# Altium schematic sheet 7_seg_display.SchDoc
size Letter; SheetNumber: 2; SheetTotal: 3
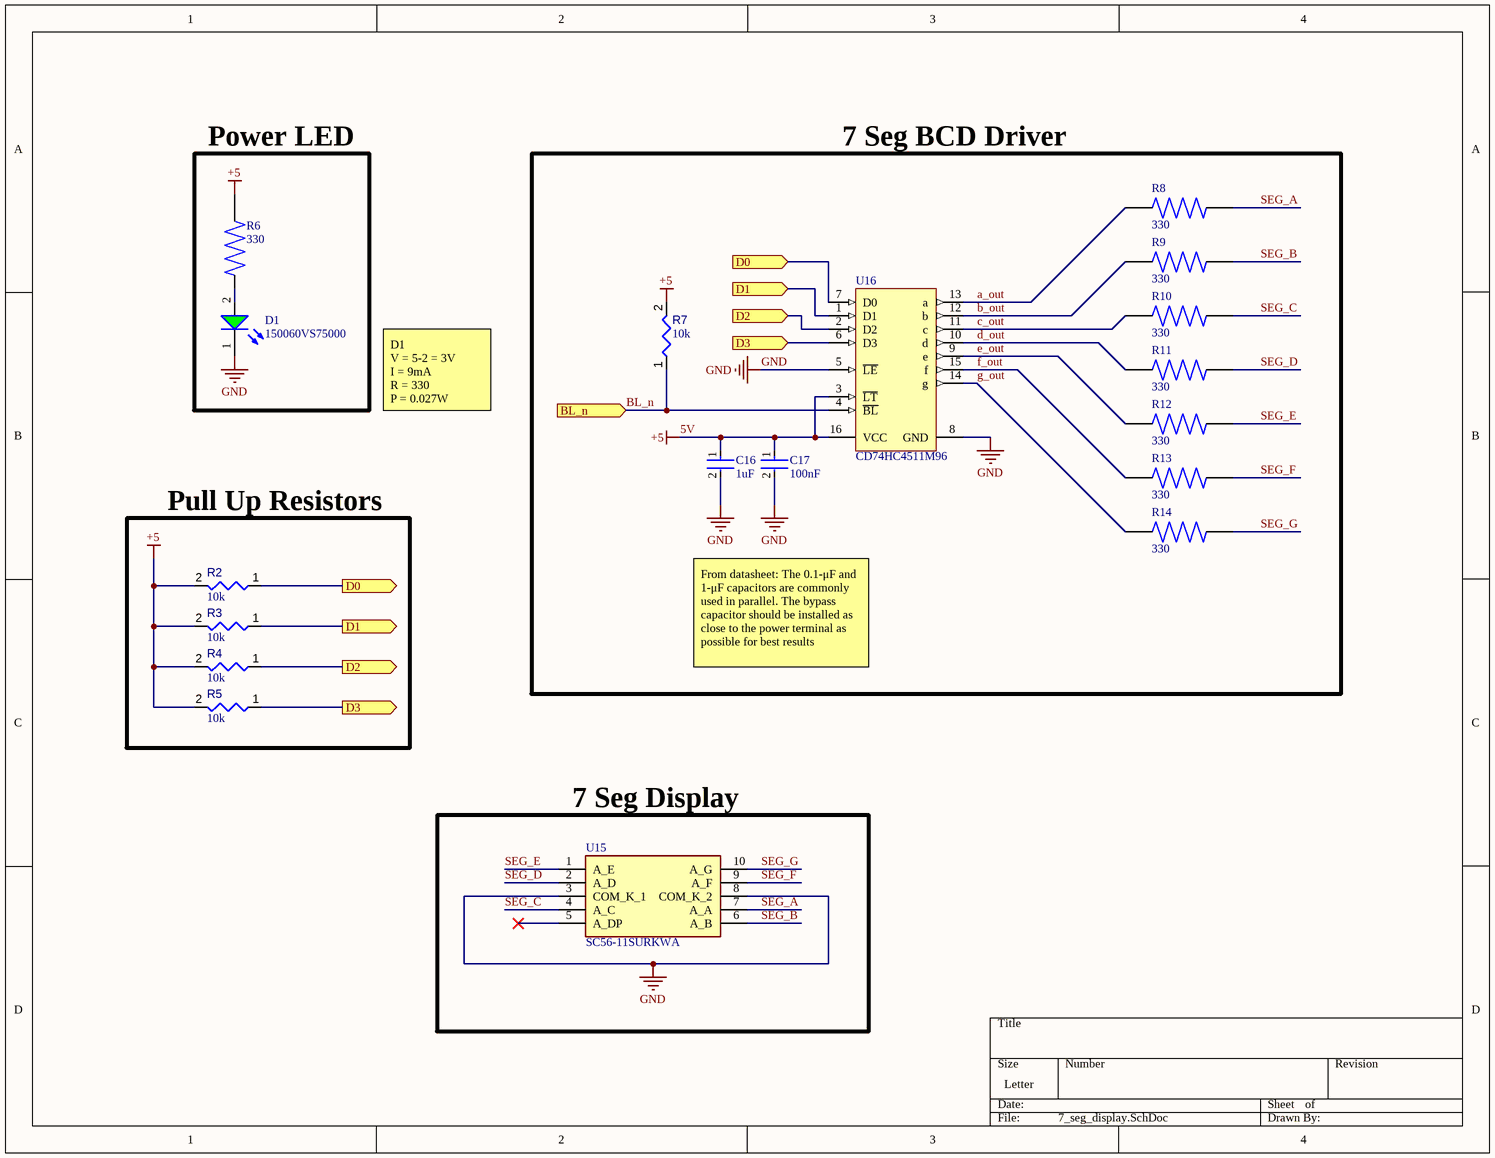
[diagram p0: 7_seg_display.SchDoc]

## Parts
C16  1uF  [FP-CGA3E-0_3-0_1-IPC_A]
C17  100nF  [FP-CL10-IPC_A]
D1  150060VS75000  [WL-SMCW_0603_150060xx75000]
R2  value 10k  [RESC1608X55X25ML10T15]  (hidden comment: Resistor 10k +/-1% 0603 100 mW)
R3  value 10k  [RESC1608X55X25ML10T15]  (hidden comment: Resistor 10k +/-1% 0603 100 mW)
R4  value 10k  [RESC1608X55X25ML10T15]  (hidden comment: Resistor 10k +/-1% 0603 100 mW)
R5  value 10k  [RESC1608X55X25ML10T15]  (hidden comment: Resistor 10k +/-1% 0603 100 mW)
R6  value 330  [RES_ERJ-PB3B3300V]  (hidden comment: ERJ-PB3B3300V)
R7  value 10k  [RESC1608X55X25ML10T15]  (hidden comment: Resistor 10k +/-1% 0603 100 mW)
R8  value 330  [RES_ERJ-PB3B3300V]  (hidden comment: ERJ-PB3B3300V)
R9  value 330  [RES_ERJ-PB3B3300V]  (hidden comment: ERJ-PB3B3300V)
R10  value 330  [RES_ERJ-PB3B3300V]  (hidden comment: ERJ-PB3B3300V)
R11  value 330  [RES_ERJ-PB3B3300V]  (hidden comment: ERJ-PB3B3300V)
R12  value 330  [RES_ERJ-PB3B3300V]  (hidden comment: ERJ-PB3B3300V)
R13  value 330  [RES_ERJ-PB3B3300V]  (hidden comment: ERJ-PB3B3300V)
R14  value 330  [RES_ERJ-PB3B3300V]  (hidden comment: ERJ-PB3B3300V)
U15  SC56-11SURKWA  [DIPS1524W75P254L1270H825Q10N]
U16  CD74HC4511M96  [D0016A_N]

## Blocks framed on the sheet
Power LED: D1 R6
7 Seg BCD Driver: C16 C17 R7-R14 U16
Pull Up Resistors: R2-R5
7 Seg Display: U15

## Ports
BL_n (in), D0 (in), D0 (out), D1 (in), D1 (out), D2 (in), D2 (out), D3 (in), D3 (out)

## Nets
5V: C16.1 C17.1 R2.2 R3.2 R4.2 R5.2 R6.2 R7.2 U16.3(~{LT}) U16.16(VCC)  [also labelled +5]
GND: C16.2 C17.2 D1.1(K) U15.3(COM_K_1) U15.8(COM_K_2) U16.5(~{LE}) U16.8(GND)
a_out: R8.2 U16.13(a)
b_out: R9.2 U16.12(b)
BL_n: R7.1 U16.4(~{BL}) ; port BL_n
c_out: R10.2 U16.11(c)
D0: R2.1 U16.7(D0) ; port D0
D1: R3.1 U16.1(D1) ; port D1
D2: R4.1 U16.2(D2) ; port D2
D3: R5.1 U16.6(D3) ; port D3
d_out: R11.2 U16.10(d)
e_out: R12.2 U16.9(e)
f_out: R13.2 U16.15(f)
g_out: R14.1 U16.14(g)
SEG_A: R8.1 U15.7(A_A)
SEG_B: R9.1 U15.6(A_B)
SEG_C: R10.1 U15.4(A_C)
SEG_D: R11.1 U15.2(A_D)
SEG_E: R12.1 U15.1(A_E)
SEG_F: R13.1 U15.9(A_F)
SEG_G: R14.2 U15.10(A_G)
NetD1_2: D1.2(A) R6.1

Not connected (* = marked no-connect by the designer): U15 5(A_DP)*

## Notes on the sheet
- D1
  V = 5-2 = 3V
  I = 9mA
  R = 330
  P = 0.027W
- From datasheet: The 0.1-μF and 1-μF capacitors are commonly used in parallel. The bypass capacitor should be installed as close to the power terminal as possible for best results

## Library data of the parts
C16 = CMP-08246-002161-1: Cap Ceramic 1uF 16V X7R 10% Pad SMD 0603 +125°C Automotive T/R; Capacitance: 1uF; Package Quantity: 4000; Voltage Rating (DC): 16V; Voltage Rating: 16V; Max Operating Temperature: 125°C; Mount: Surface Mount; Length: 0.063inch; Width: 0.8mm; Weight: 7.1E-05oz; Lead Free: Lead Free; Thickness: 0.035inch; Case/Package: 0603; REACH SVHC: No SVHC; Tolerance: 10%; Min Operating Temperature: -55°C; Termination: SMD/SMT; Case Code (Imperial): 0603; Height: 0.8mm; Case Code (Metric): 1608; Packaging: Tape and Reel; Ratings: AEC-Q200; Dielectric: X7R
C17 = CMP-13271-002683-1: Cap Ceramic 100nF 16V X7R ±10% Pad SMD 0603 +125°C T/R; Voltage Rating: 16V; Max Operating Temperature: 125°C; Capacitance: 100nF; Features: Soft Termination; Length: 0.063inch; Packaging: Tape and Reel; Min Operating Temperature: -55°C; Mount: Surface Mount; Case/Package: 0603; Case Code (Metric): 1608; Width: 0.031inch; Ratings: AEC-Q200; Thickness: 0.035inch; Case Code (Imperial): 0603; Tolerance: 10%
D1 = CMP-1426-00006-7: WURTH ELEKTRONIK - 150060VS75000 - LED, Green, SMD, 0603, 30 mA, 2 V, 570 nm; Reverse Voltage: 5V; Power Dissipation: 72mW; Dominant Wavelength: 570nm; Peak Wavelength: 572nm; Forward Current: 100mA; Forward Voltage: 2V; Lens Style: Clear, Rectangular; Test Current: 20mA; Max Junction Temperature (Tj): 95°C; Viewing Angle: 140°; Luminous Intensity: 40mcd; Height: 700µm; Width: 800µm; Length: 1.6mm; Mount: Surface Mount; Min Operating Temperature: -40°C; Max Reverse Voltage (DC): 5V; Case Code (Imperial): 0603; Wavelength: 570nm; Color: Green; REACH SVHC: Unknown; RoHS: Compliant; Max Operating Temperature: 85°C; Packaging: Tape and Reel; Case/Package: 0603; Number of Pins: 2; Case Code (Metric): 1608
R2-R5 R7 = CMP-009-00017-5: Chip Resistor, 10 KOhm, +/- 1%, 01 W, -55 to 155 degC, 0603 (1608 Metric); Voltage Rating: 50V; Power: 100mW; RoHS Compliant: True; Min Operating Temperature: -55°C; Pins: 2; Case/Package: 0603; Mounting Technology: SM; Max Operating Temperature: 155°C; Tolerance: 1%
R6 R8-R14 = CMP-009-00177-1: Series/Type: High Precision Thick Film Chip Resistors , Power Rating (W): 0.2, Chip Size (LxW(EIA)) (mm): 1.6 x 0.8 (EIA:0603), Resistance Values (鈩; MF: Panasonic; Availability: In Stock; MP: ERJ-PB3B3300V; Component Type: Standard; Purchase-URL: https://pricing.snapeda.com/search/part/ERJ-PB3B3300V/?ref=eda; Source: ERJ-PB3B3300V.SchLib; Design Item ID: ERJ-PB3B3300V; Pins: 2; SnapEDA_Link: https://www.snapeda.com/parts/ERJ-PB3B3300V/Panasonic/view-part/?ref=snap; Price: None; Case/Package: 603-2 Panasonic; Check_prices: https://www.snapeda.com/parts/ERJ-PB3B3300V/Panasonic/view-part/?ref=eda
  R8: ComponentLink1Description: Digikey; ComponentLink1URL: https://www.digikey.ca/en/products/detail/panasonic-electronic-components/ERJ-PB3B3300V/6212698
U15 = SC56-11SURKWA: Display; Manufacturer_Name: Kingbright; Datasheet Link: https://www.kingbrightusa.com/images/catalog/SPEC/SC56-11SURKWA.pdf; Height: 8.25mm; Manufacturer_Part_Number: SC56-11SURKWA; Mouser Part Number: 604-SC56-11SURKWA; Mouser Price/Stock: https://www.mouser.co.uk/ProductDetail/Kingbright/SC56-11SURKWA?qs=FRBiz4Wv1YPfPJAshkDmnw%3D%3D; Arrow Part Number: SC56-11SURKWA; Arrow Price/Stock: https://www.arrow.com/en/products/sc56-11surkwa/kingbright?region=europe
U16 = CMP-0388-00023-2: High Speed CMOS Logic BCD-to-7-Segment Latch / Decoder / Driver, 2 to 6 V, -55 to 125 degC, 16-pin SOIC (D16), Green (RoHS & no Sb/Br); Manufacturer: Texas Instruments; Vin(Min)(V): 2; Vin(Max)(V): 6; SubFamily: Discrete Segment LED Driver; Rating: Catalog; PackageVersion: 4040047-6/M; ComponentLink1Description: Manufacturer URL; ComponentLink3URL: http://www.ti.com/litv/pdf/mpds178g; ComponentLink2URL: http://www.ti.com/general/docs/lit/getliterature.tsp?genericPartNumber=CD74HC4511&fileType=pdf; PartNumber: CD74HC4511M96; ComponentLink1URL: http://www.ti.com/; Code_JEDEC: MS-012; DatasheetVersion: SCHS279D; ComponentLink2Description: Datasheet; Mounting Technology: Surface Mount; PackageReference: D0016A; Eco-Plan: Green (RoHS & no Sb/Br); PackageDescription: 16-Pin Plastic Small Outline, Body 9.90 x 3.90 mm, Pitch 1.27 mm; ComponentLink3Description: Package Specification